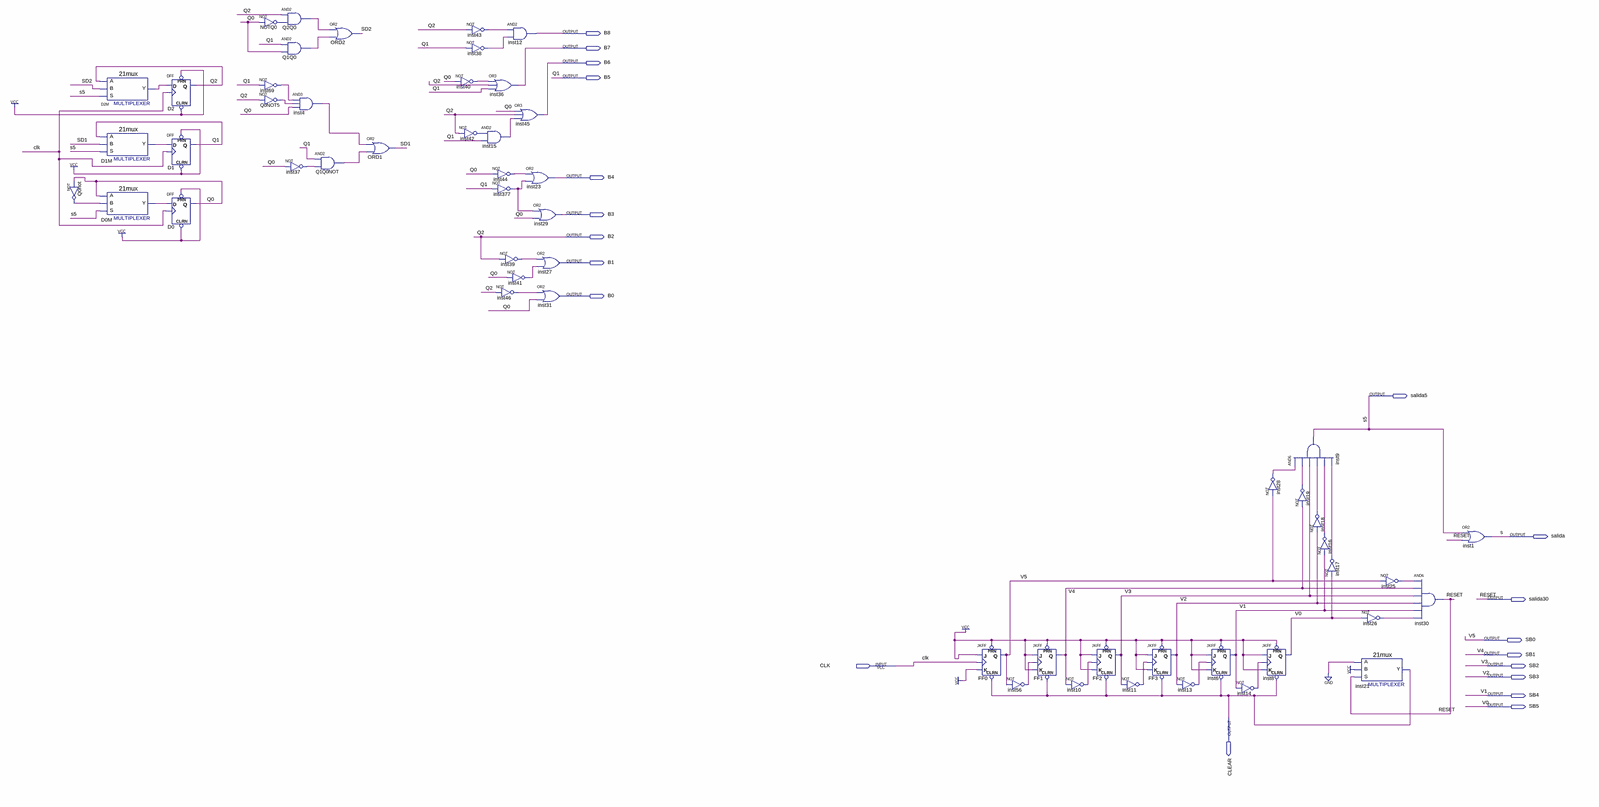
[diagram p0: schematic sheet, whole]
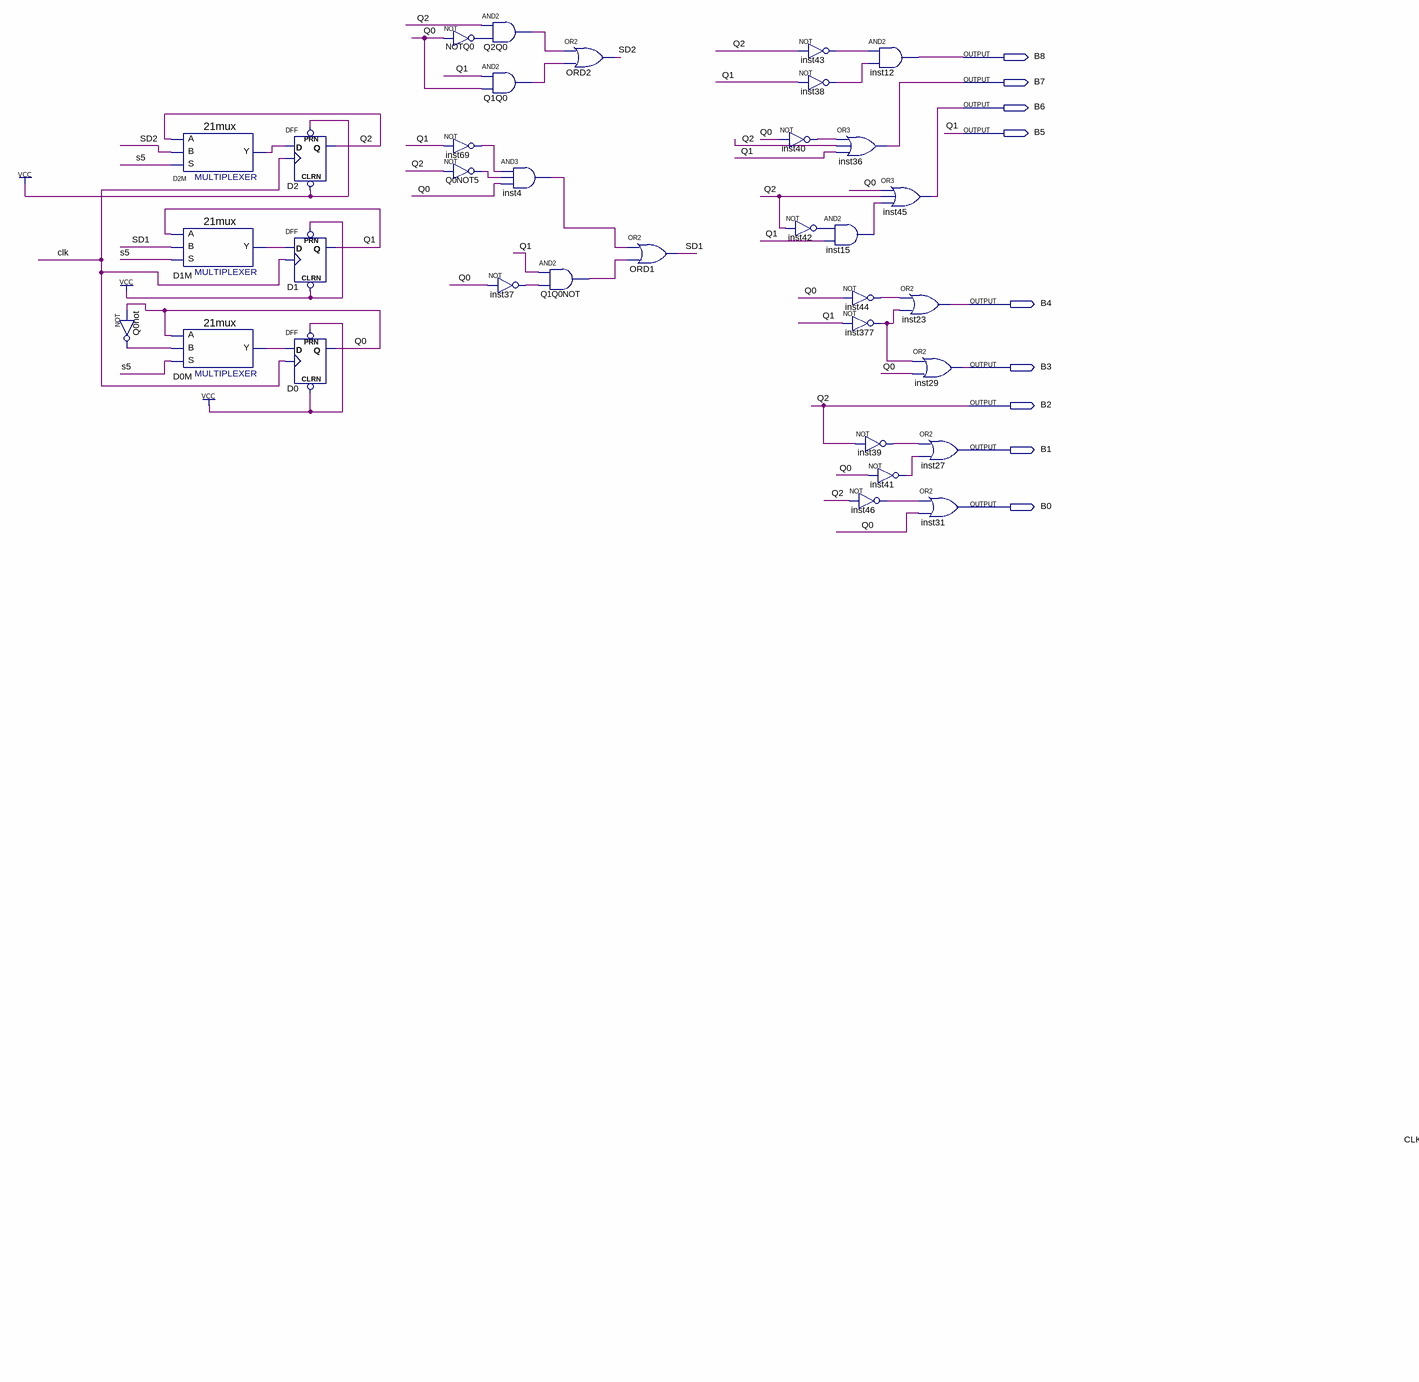
[diagram p1: schematic sheet, left part]
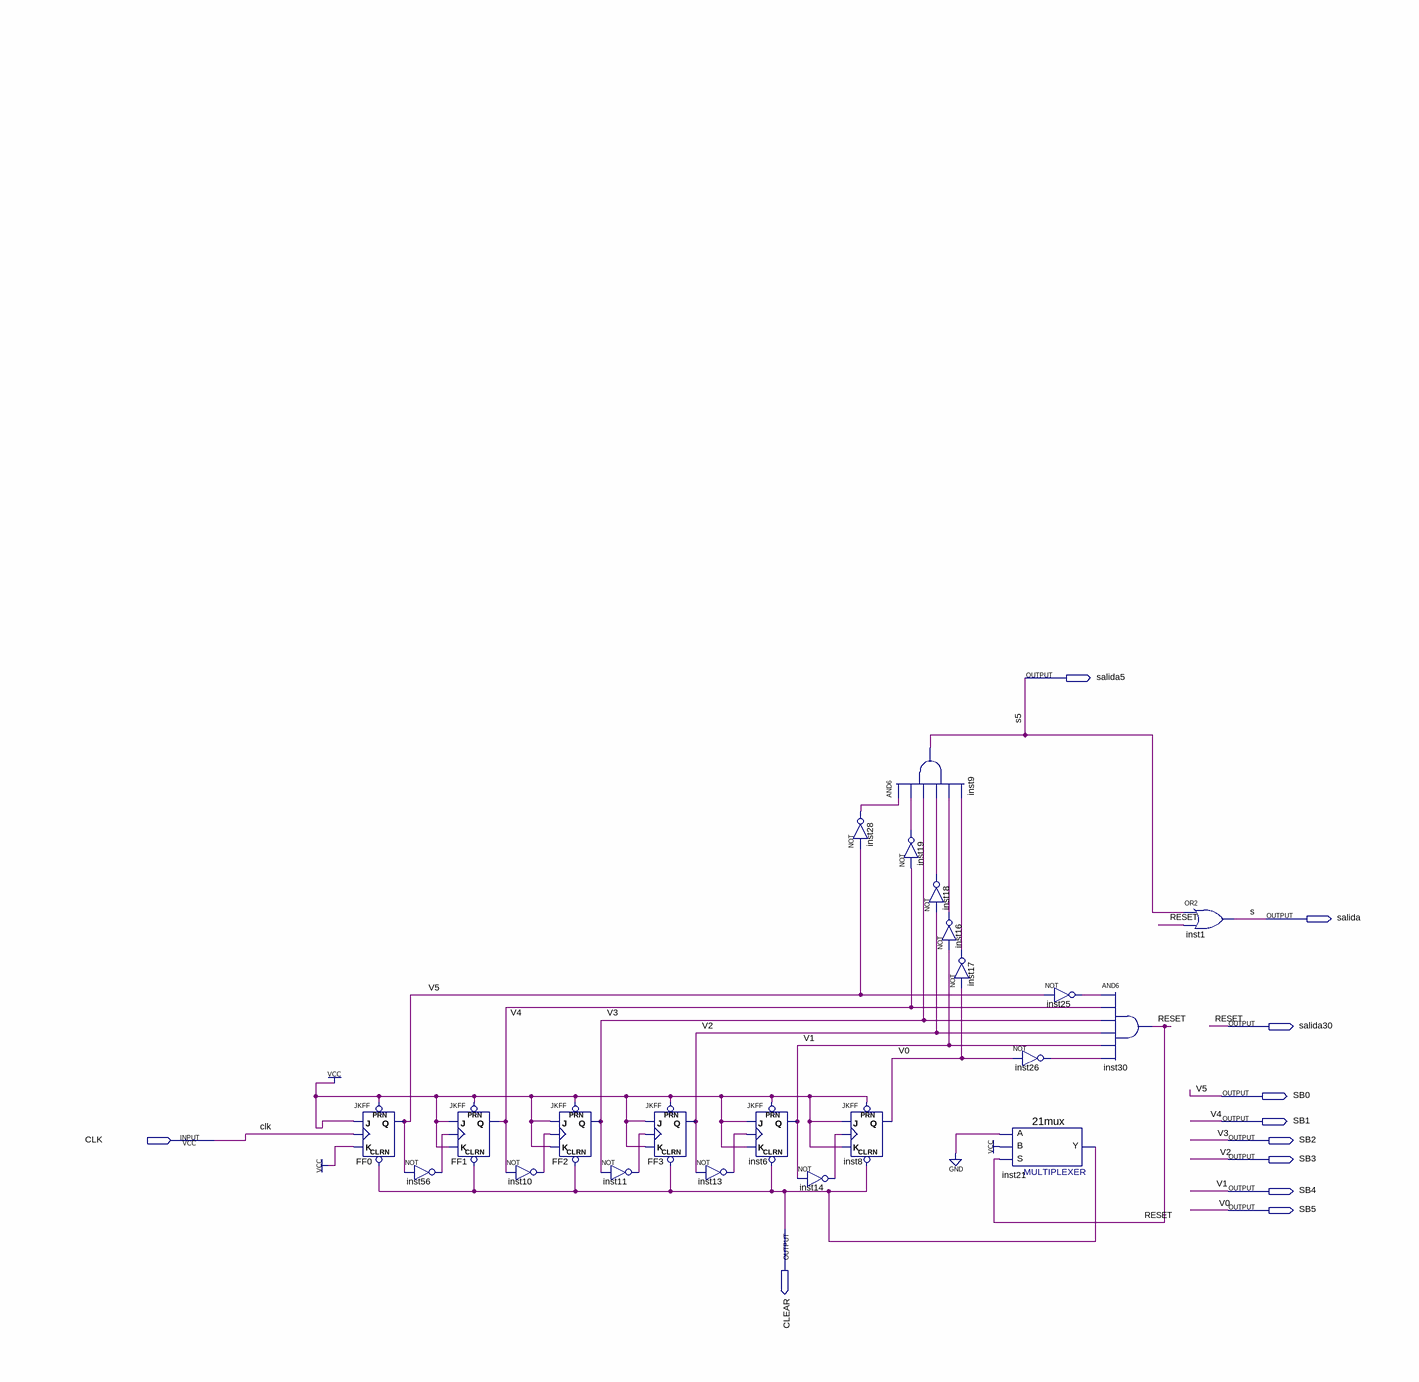
[diagram p2: schematic sheet, right part]
// Quartus schematic tp2.bdf as structural Verilog: 56 symbols, 20 pins
module tp2 (
  input  CLK,
  output B8,
  output B7,
  output B6,
  output B5,
  output B4,
  output B3,
  output B2,
  output B1,
  output B0,
  output salida5,
  output salida,
  output salida30,
  output SB0,
  output SB1,
  output SB2,
  output SB3,
  output SB4,
  output SB5,
  output CLEAR
);

  wire D0M_y, D1M_y, D2M_y, inst4_out, inst10_out, inst11_out, inst13_out, inst14_out, inst15_out,
       inst16_out, inst17_out, inst18_out, inst19_out, inst25_out, inst26_out, inst28_out, inst37_out,
       inst38_out, inst39_out, inst40_out, inst41_out, inst42_out, inst43_out, inst44_out, inst46_out,
       inst56_out, inst69_out, inst377_out, NOTQ0_out, Q0, Q0NOT5_out, Q0not_out, Q1Q0_out, Q1Q0NOT_out,
       Q2Q0_out, SD1, SD2;

  not Q0not (Q0not_out, Q0);
  \21mux  D2M (.S(salida5), .B(SD2), .A(B2), .Y(D2M_y));
  \21mux  D1M (.S(salida5), .B(SD1), .A(B5), .Y(D1M_y));
  \21mux  D0M (.S(salida5), .B(Q0not_out), .A(Q0), .Y(D0M_y));
  DFF D2 (.CLRN(1'b1), .CLK(CLK), .D(D2M_y), .PRN(1'b1), .Q(B2));
  DFF D1 (.CLRN(1'b1), .CLK(CLK), .D(D1M_y), .PRN(1'b1), .Q(B5));
  DFF D0 (.CLRN(1'b1), .CLK(CLK), .D(D0M_y), .PRN(1'b1), .Q(Q0));
  not NOTQ0 (NOTQ0_out, Q0);
  not inst69 (inst69_out, B5);
  not Q0NOT5 (Q0NOT5_out, B2);
  and Q2Q0 (Q2Q0_out, B2, NOTQ0_out);
  and Q1Q0 (Q1Q0_out, B5, Q0);
  and inst4 (inst4_out, inst69_out, Q0NOT5_out, Q0);
  not inst37 (inst37_out, Q0);
  or ORD2 (SD2, Q2Q0_out, Q1Q0_out);
  and Q1Q0NOT (Q1Q0NOT_out, B5, inst37_out);
  or ORD1 (SD1, inst4_out, Q1Q0NOT_out);
  not inst40 (inst40_out, Q0);
  not inst43 (inst43_out, B2);
  not inst38 (inst38_out, B5);
  and inst15 (inst15_out, inst42_out, B5);
  not inst42 (inst42_out, B2);
  and inst12 (B8, inst43_out, inst38_out);
  or inst36 (B7, inst40_out, B2, B5);
  or inst45 (B6, Q0, B2, inst15_out);
  not inst44 (inst44_out, Q0);
  not inst377 (inst377_out, B5);
  not inst39 (inst39_out, B2);
  not inst41 (inst41_out, Q0);
  not inst46 (inst46_out, B2);
  or inst23 (B4, inst44_out, inst377_out);
  or inst29 (B3, inst377_out, Q0);
  or inst27 (B1, inst39_out, inst41_out);
  or inst31 (B0, inst46_out, Q0);
  JKFF FF0 (.PRN(1'b1), .CLRN(CLEAR), .K(1'b1), .J(1'b1), .CLK(CLK), .Q(SB0));
  not inst56 (inst56_out, SB0);
  JKFF FF1 (.PRN(1'b1), .CLRN(CLEAR), .K(1'b1), .J(1'b1), .CLK(inst56_out), .Q(SB1));
  not inst10 (inst10_out, SB1);
  JKFF FF2 (.PRN(1'b1), .CLRN(CLEAR), .K(1'b1), .J(1'b1), .CLK(inst10_out), .Q(SB2));
  not inst11 (inst11_out, SB2);
  JKFF FF3 (.PRN(1'b1), .CLRN(CLEAR), .K(1'b1), .J(1'b1), .CLK(inst11_out), .Q(SB3));
  not inst13 (inst13_out, SB3);
  JKFF inst6 (.PRN(1'b1), .CLRN(CLEAR), .K(1'b1), .J(1'b1), .CLK(inst13_out), .Q(SB4));
  not inst14 (inst14_out, SB4);
  not inst28 (inst28_out, SB0);
  JKFF inst8 (.PRN(1'b1), .CLRN(CLEAR), .K(1'b1), .J(1'b1), .CLK(inst14_out), .Q(SB5));
  and inst9 (salida5, inst28_out, inst19_out, SB2, inst18_out, inst16_out, inst17_out);
  not inst19 (inst19_out, SB1);
  not inst18 (inst18_out, SB3);
  not inst16 (inst16_out, SB4);
  not inst17 (inst17_out, SB5);
  not inst26 (inst26_out, SB5);
  \21mux  inst21 (.S(salida30), .B(1'b1), .A(1'b0), .Y(CLEAR));
  not inst25 (inst25_out, SB0);
  and inst30 (salida30, inst25_out, SB1, SB2, SB3, SB4, inst26_out);
  or inst1 (salida, salida5, salida30);

  // Other names for the same wires on the sheet: Q1 = B5; Q2 = B2; RESET = salida30; s = salida; s5 = salida5;
  //   V0 = SB5; V1 = SB4; V2 = SB3; V3 = SB2; V4 = SB1; V5 = SB0
endmodule
